# Altium project 2017_07_WallClock.PrjPCB
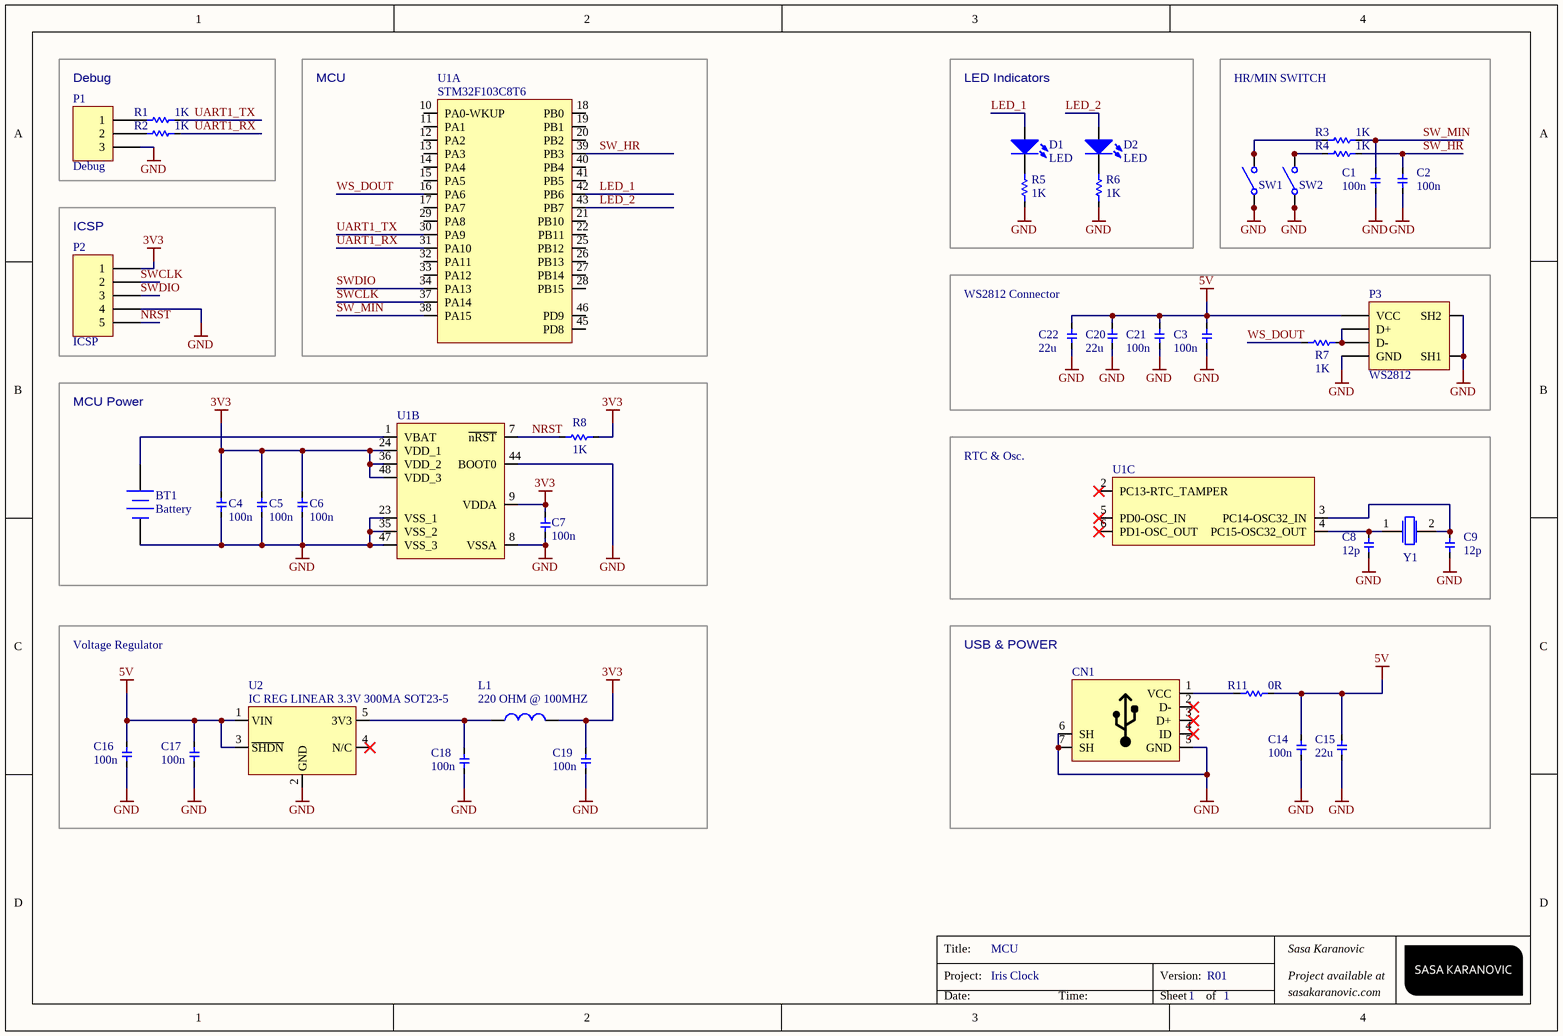
[diagram p0: 01_MCU.SchDoc]
1 sheet, 40 parts. Net scope: global (net labels, ports and power ports of the same name join across sheets).
Board file: WallClock_PCB.PcbDoc

## Sheet 01_MCU.SchDoc: MCU
size A4; SheetNumber: 1; SheetTotal: 1; PageSetup: Record=PageOptions|CenterHorizontal=True|CenterVertical=True|PrintScale=1.09|XCorrection=1.00|YCorrection=1.00|PrintKind=0|BorderSize=5000000|LeftOffset=0|BottomOffset=0|Orientation=2|PaperLength=1000|PaperWidth=1000|Scale=100|PaperSource=7|PrintQuality=-3|MediaType=1|DitherType=10|PrintScaleMode=1|PaperKind=A4|PaperIndex=9; SK_ProjectName: Iris Clock; Version: R01

### Parts
BT1  Battery  [CR2032 SMD]
C1  value 100n  [0603 - CAP]  (hidden comment: Cap)
C2  value 100n  [0603 - CAP]  (hidden comment: Cap)
C3  value 100n  [0603 - CAP]  (hidden comment: Cap)
C4  value 100n  [0603 - CAP]  (hidden comment: Cap)
C5  value 100n  [0603 - CAP]  (hidden comment: Cap)
C6  value 100n  [0603 - CAP]  (hidden comment: Cap)
C7  value 100n  [0603 - CAP]  (hidden comment: Cap)
C8  value 12p  [0603 - CAP]  (hidden comment: Cap)
C9  value 12p  [0603 - CAP]  (hidden comment: Cap)
C14  value 100n  [0603 - CAP]  (hidden comment: Cap)
C15  value 22u  [0603 - CAP]  (hidden comment: Cap)
C16  value 100n  [0603 - CAP]  (hidden comment: Cap)
C17  value 100n  [0603 - CAP]  (hidden comment: Cap)
C18  value 100n  [0603 - CAP]  (hidden comment: Cap)
C19  value 100n  [0603 - CAP]  (hidden comment: Cap)
C20  value 22u  [0805]  (hidden comment: Cap)
C21  value 100n  [0603 - CAP]  (hidden comment: Cap)
C22  value 22u  [0805]  (hidden comment: Cap)
CN1  USB Connector  [Amphenol FCI 10118192-0001LF]  (value not drawn)
D1  LED  [0603 Diode]
D2  LED  [0603 Diode]
L1  220 OHM @ 100MHZ  [0603]
P1  Debug  [Header 3x1 SMD]  (no BOM)
P2  ICSP  [Header 5x1 SMD]  (no BOM)
P3  WS2812  [USB Mini SMD TOP]
R1  value 1K  [0603]  (hidden comment: Res)  (no BOM)
R2  value 1K  [0603]  (hidden comment: Res)  (no BOM)
R3  value 1K  [0603]  (hidden comment: Res)
R4  value 1K  [0603]  (hidden comment: Res)
R5  value 1K  [0603]  (hidden comment: Res)
R6  value 1K  [0603]  (hidden comment: Res)
R7  value 1K  [0603]  (hidden comment: Res)
R8  value 1K  [0603]  (hidden comment: Res)
R11  value 0R  [0603]  (hidden comment: Res)
SW1  SWITCH TACTILE SPST-NO 0.05A 12V  [PTS645]  (value not drawn)
SW2  SWITCH TACTILE SPST-NO 0.05A 12V  [PTS645]  (value not drawn)
U1  STM32F103C8T6  [LQFP48_7x7mm]  (parts A,B,C of 3)
U2  IC REG LINEAR 3.3V 300MA SOT23-5  [SOT-23-5]
Y1  32.7680KHZ 6PF SMD  [ABS07-120]  (value not drawn)

### Blocks framed on the sheet
Debug: P1 R1 R2
MCU: U1
LED Indicators: D1 D2 R5 R6
HR/MIN SWITCH: C1 C2 R3 R4 SW1 SW2
ICSP: P2
WS2812 Connector: C3 C20-C22 P3 R7
MCU Power: BT1 C4-C7 R8 U1
RTC & Osc.: C8 C9 U1 Y1
Voltage Regulator: C16-C19 L1 U2
USB & POWER: C14 C15 CN1 R11

### Nets
3V3: C4.2 C5.2 C6.2 C7.2 C19.2 L1.2 P2.1 R8.1 U1.9(VDDA) U1.24(VDD_1) U1.36(VDD_2) U1.48(VDD_3)
5V: C3.2 C14.2 C15.2 C16.2 C17.2 C20.2 C21.2 C22.2 P3.VCC R11.2 U2.1(VIN) U2.3(~{SHDN})
GND: BT1.2(-) C1.1 C2.1 C3.1 C4.1 C5.1 C6.1 C7.1 C8.1 C9.1 C14.1 C15.1 C16.1 C17.1 C18.1 C19.1 C20.1 C21.1 C22.1 CN1.5(GND) CN1.6(SH) CN1.7(SH) P1.3 P2.4 P3.GND P3.SH1 P3.SH2 R5.1 R6.1 SW1.1(COMMON1) SW1.2(COMMON1) SW2.1(COMMON1) SW2.2(COMMON1) U1.8(VSSA) U1.23(VSS_1) U1.35(VSS_2) U1.44(BOOT0) U1.47(VSS_3) U2.2(GND)
LED_1: D1.A U1.42(PB6)
LED_2: D2.A U1.43(PB7)
NRST: P2.5 R8.2 U1.7(~{nRST})
SW_HR: C2.2 R4.1 U1.39(PB3)
SW_MIN: C1.2 R3.1 U1.38(PA15)
SWCLK: P2.2 U1.37(PA14)
SWDIO: P2.3 U1.34(PA13)
UART1_RX: R2.2 U1.31(PA10)
UART1_TX: R1.2 U1.30(PA9)
WS_DOUT: R7.1 U1.16(PA6)
NetBT1_1: BT1.1(+) U1.1(VBAT)
NetC8_2: C8.2 U1.4(PC15-OSC32_OUT) Y1.1(OSC1)
NetC9_2: C9.2 U1.3(PC14-OSC32_IN) Y1.2(OSC2)
NetC18_2: C18.2 L1.1 U2.5(3V3)
NetCN1_1: CN1.1(VCC) R11.1
NetD1_K: D1.K R5.2
NetD2_K: D2.K R6.2
NetP1_1: P1.1 R1.1
NetP1_2: P1.2 R2.1
NetP3_D+: P3.D+ P3.D- R7.2
NetR3_2: R3.2 SW1.3(COMMON2) SW1.4(COMMON2)
NetR4_2: R4.2 SW2.3(COMMON2) SW2.4(COMMON2)

Not connected (* = marked no-connect by the designer): CN1 2(D-)* 3(D+)* 4(ID)*; U1 2(PC13-RTC_TAMPER)* 5(PD0-OSC_IN)* 6(PD1-OSC_OUT)* 10(PA0-WKUP) 11(PA1) 12(PA2) 13(PA3) 14(PA4) 15(PA5) 17(PA7) 18(PB0) 19(PB1) 20(PB2) 21(PB10) 22(PB11) 25(PB12) 26(PB13) 27(PB14) 28(PB15) 29(PA8) 32(PA11) 33(PA12) 40(PB4) 41(PB5) 45(PD8) 46(PD9); U2 4(N/C)*

### Notes on the sheet
- Title:
- Project:
- Version:
- sasakaranovic.com
- Sasa Karanovic
- Project available at
- Date:
- Time:
- Sheet
- of

### Library data of the parts
BT1 = Battery: Multicell Battery; Manufacturer: MPD (Memory Protection Devices); Manufacturer Part Number: BK-883-TR; Distributor: DigiKey; Distributor Part Number: BK-883-CT-ND
C1-C7 C14 C16-C19 C21 = Cap: Capacitor; Manufacturer: Samsung Electro-Mechanics; Manufacturer Part Number: CL10A104KA8NNNC; Distributor Part Number: 1276-1857-1-ND; Distributor: DigiKey
C8 C9 = Cap: Capacitor; Manufacturer: AVX Corporation; Manufacturer Part Number: 06031A120JAT4A; Distributor Part Number: 478-10188-1-ND; Distributor: DigiKey
C15 C20 C22 = Cap: Capacitor; Manufacturer: Samsung Electro-Mechanics; Manufacturer Part Number: CL21A226MOCLRNC; Distributor Part Number: 1276-6780-1-ND; Distributor: DigiKey
CN1 = Amphenol FCI 10118192-0001LF: CONN USB MICRO B RECPT SMT R/A; Distributor: DigiKey; Manufacturer: Amphenol FCI; Distributor Part Number: 609-4613-1-ND; Manufacturer Part Number: 10118192-0001LF
D1 = LED: Typical RED GaAs LED; Manufacturer: Inolux; Manufacturer Part Number: IN-S63AT5A; Distributor: DigiKey; Distributor Part Number: 1830-1064-1-ND
D2 = LED: Typical RED GaAs LED; Manufacturer: OSRAM Opto Semiconductors Inc.; Manufacturer Part Number: LW Q38G-Q1OO-3K6L-1; Distributor: DigiKey; Distributor Part Number: 475-2832-1-ND
L1 = Inductor: FERRITE BEAD 220 OHM 0603 1LN; Manufacturer: Murata Electronics North America; Manufacturer Part Number: BLM18PG221SN1D; Distributor: DigiKey; Distributor Part Number: 490-5221-1-ND
P1 = Header 3: Header, 3-Pin; Distributor: DigiKey
P2 = Header 5: Header, 5-Pin; Distributor: DigiKey
P3 = USB Connector: CONN MINI USB RCPT RA TYPE B SMD; Manufacturer: EDAC Inc.; Manufacturer Part Number: 690-005-299-043; Distributor: DigiKey; Distributor Part Number: 151-1206-1-ND
R1-R8 = Res: Resistor; Manufacturer: Yageo; Manufacturer Part Number: RC0603JR-071KL; Distributor: DigiKey; Distributor Part Number: 311-1.0KGRCT-ND
R11 = Res: Resistor; Manufacturer: Yageo; Manufacturer Part Number: RC0603JR-070RL; Distributor: DigiKey; Distributor Part Number: 311-0.0GRCT-ND
SW1 SW2 = PTS645SL50SMTR92 LFS: Manufacturer: C&K; Distributor Part Number: CKN9088CT-ND; Manufacturer Part Number: PTS645SL50SMTR92 LFS; Distributor: DigiKey
U1 = STM32F103C8T6: IC MCU 32BIT 64KB FLASH 48LQFP; Manufacturer: STMicroelectronics; Distributor: DigiKey; Distributor Part Number: 497-6063-ND; Manufacturer Part Number: STM32F103C8T6
U2 = AP2127K-3.3TRG1: Manufacturer: Diodes Incorporated; Distributor: DigiKey; Distributor Part Number: AP2127K-3.3TRG1DICT-ND; Manufacturer Part Number: AP2127K-3.3TRG1
Y1 = ABS07-120-32.768KHZ-T: CRYSTAL 32.7680KHZ 6PF SMD; Manufacturer: Abracon LLC; Distributor: DigiKey; Distributor Part Number: 535-11937-1-ND; Manufacturer Part Number: ABS07-120-32.768KHZ-T

## Assembly variants
Production Build: not fitted P1 P2